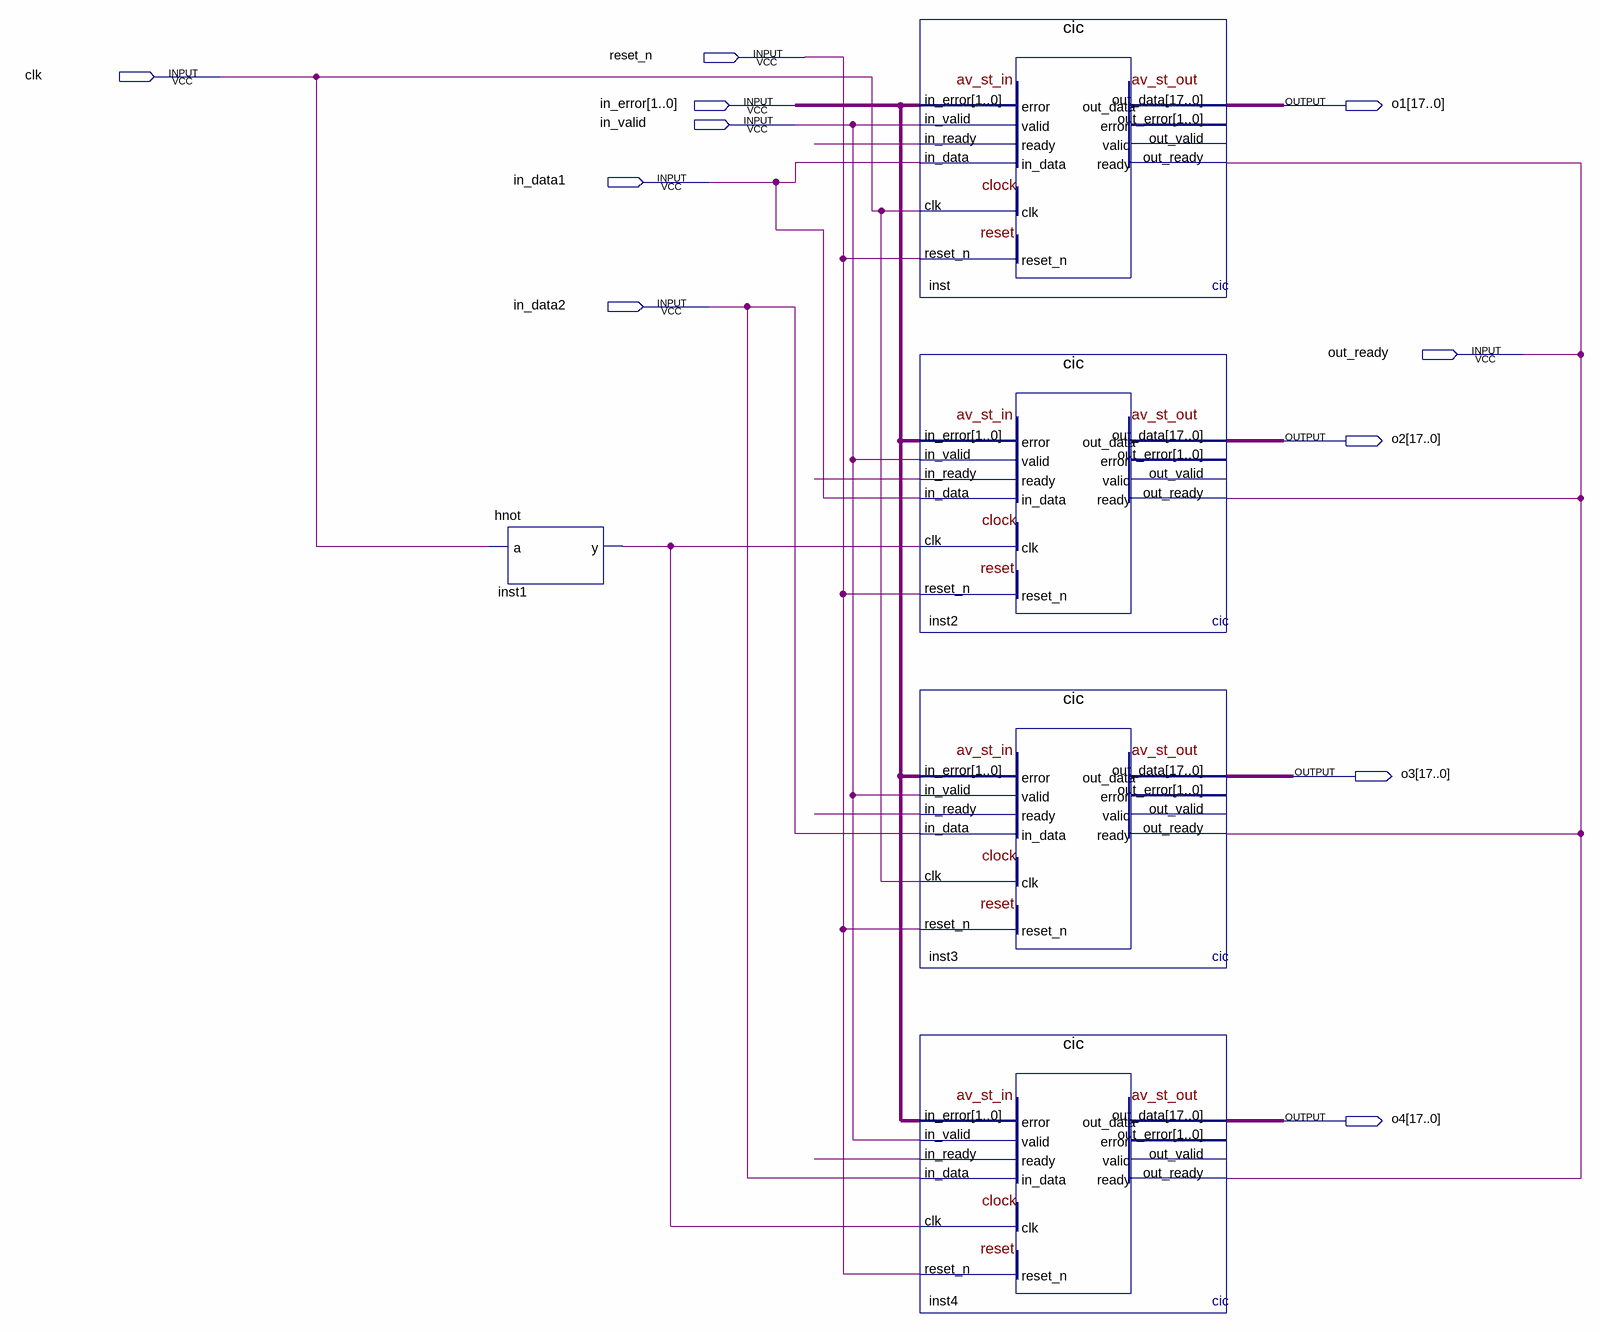
[diagram p0: schematic sheet]
// Quartus schematic cicpdm.bdf as structural Verilog: 5 symbols, 11 pins
module cicpdm (
  input  reset_n,
  input  clk,
  input  [1:0] in_error,
  input  in_valid,
  input  in_data1,
  input  in_data2,
  input  out_ready,
  output [17:0] o1,
  output [17:0] o2,
  output [17:0] o3,
  output [17:0] o4
);

  wire inst1_y, inst2_in_ready, inst3_in_ready, inst4_in_ready, inst_in_ready;

  hnot inst1 (.a(clk), .y(inst1_y));
  cic inst (
    .in_error(in_error), .in_valid(in_valid), .in_data(in_data1), .out_ready(out_ready), .clk(clk),
    .reset_n(reset_n), .in_ready(inst_in_ready), .out_data(o1));  // open: out_error, out_valid
  cic inst2 (
    .in_error(in_error), .in_valid(in_valid), .in_data(in_data1), .out_ready(out_ready), .clk(inst1_y),
    .reset_n(reset_n), .in_ready(inst2_in_ready), .out_data(o2));  // open: out_error, out_valid
  cic inst3 (
    .in_error(in_error), .in_valid(in_valid), .in_data(in_data2), .out_ready(out_ready), .clk(clk),
    .reset_n(reset_n), .in_ready(inst3_in_ready), .out_data(o3));  // open: out_error, out_valid
  cic inst4 (
    .in_error(in_error), .in_valid(in_valid), .in_data(in_data2), .out_ready(out_ready), .clk(inst1_y),
    .reset_n(reset_n), .in_ready(inst4_in_ready), .out_data(o4));  // open: out_error, out_valid
endmodule
